# EAGLE design usb-midi-shield (EAGLE 6.1)
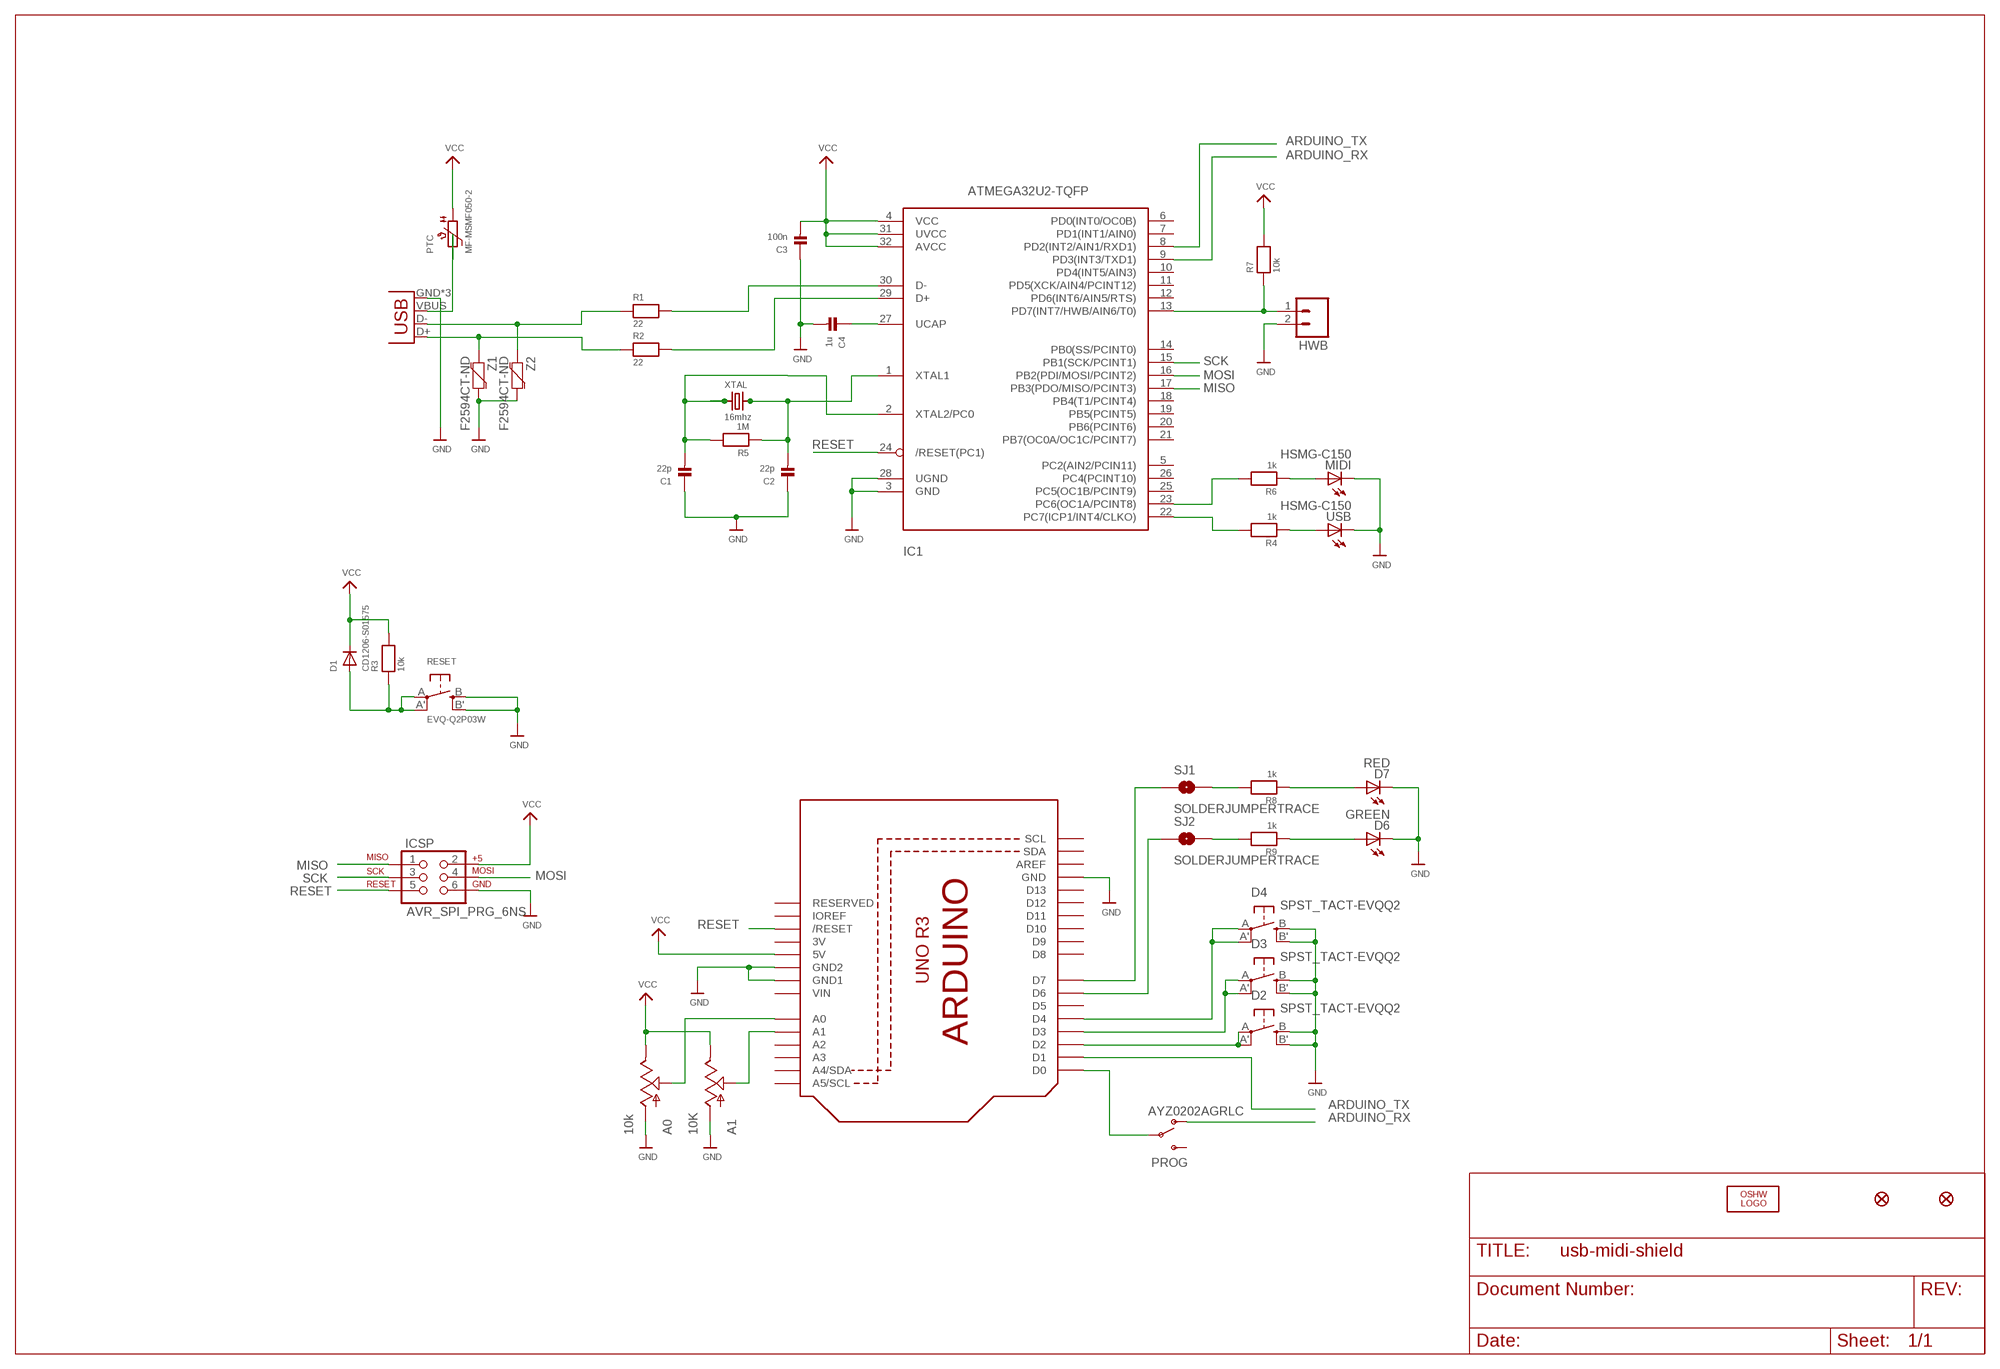
[diagram p0: schematic, sheet 1]

## Parts
A0  10k  POT  [ALPS_POT]
A1  10K  POT  [ALPS_POT]
C1  22p  CAP_CERAMIC0603  [0603]
C2  22p  CAP_CERAMIC0603  [0603]
C3  100n  CAP_CERAMIC0603  [0603]
C4  1u  CAP_CERAMIC0603  [0603]
D1  CD1206-S01575  DIODESOD-123  [SOD-123]
D2  SPST_TACT-EVQQ2  [EVQ-Q2]
D3  SPST_TACT-EVQQ2  [EVQ-Q2]
D4  SPST_TACT-EVQQ2  [EVQ-Q2]
D6  GREEN  LED-GREENLARGE  [LED-1206]
D7  RED  LED-GREENLARGE  [LED-1206]
FID1  FIDUCIAL1.5X3  [FIDUCIAL-1.5X3]
FID2  FIDUCIAL1.5X3  [FIDUCIAL-1.5X3]
HWB  M02LOCK  [1X02_LOCK]
IC1  ATMEGA32U2-TQFP  [TQFP32-08]
ICSP  AVR_SPI_PRG_6NS  [2X3-NS]
JP1  USB-MICROB  [USB-MICROB]
LOGO1  OSHW_LOGO_FILLX0350-NT  [OSHW_FILLX350_NOTEXT]
MIDI  HSMG-C150  LED-GREENLARGE  [LED-1206]
PROG  AYZ0202AGRLC  SWITCH-SPDTSMD  [AYZ0202]
PTC  MF-MSMF050-2  PTC1812  [PTC1812]
R1  22  RESISTOR0805  [0805]
R2  22  RESISTOR0805  [0805]
R3  10k  RESISTOR0805  [0805]
R4  1k  RESISTOR0805  [0805]
R5  1M  RESISTOR0805  [0805]
R6  1k  RESISTOR0805  [0805]
R7  10k  RESISTOR0805  [0805]
R8  1k  RESISTOR0805  [0805]
R9  1k  RESISTOR0805  [0805]
RESET  EVQ-Q2P03W  SWITCH_TACT_SMT  [EVQ-Q2]
SJ1  SOLDERJUMPERTRACE  [SJ_2S-TRACE]
SJ2  SOLDERJUMPERTRACE  [SJ_2S-TRACE]
U1  ARDUINOR3NODIM  [ARDUINOR3-NODIM]
USB  HSMG-C150  LED-GREENLARGE  [LED-1206]
XTAL  16mhz  CRYSTALSMD  [HC49UP]
Z1  F2594CT-ND  VARISTOR-0603  [0603-RES]
Z2  F2594CT-ND  VARISTOR-0603  [0603-RES]

## Nets
ARDUINO_RX: IC1.9(PD3(INT3/TXD1)) PROG.1(O)
ARDUINO_TX: IC1.8(PD2(INT2/AIN1/RXD1)) U1.D1
D-: IC1.29(D+) R2.2
GND: A0.P$3(A) A1.P$3(A) C1.1 C2.1 C3.1 C4.2 D2.B'(S1) D2.B(S) D3.B'(S1) D3.B(S) D4.B'(S1) D4.B(S) D6.C D7.C HWB.2 IC1.3(GND) IC1.28(UGND) ICSP.6 JP1.GND JP1.MT1(GND) JP1.MT2(GND) MIDI.C RESET.B'(S1) RESET.B(S) U1.GND U1.GND1 U1.GND2 USB.C Z1.2 Z2.2
MISO: IC1.17(PB3(PDO/MISO/PCINT3)) ICSP.1
MOSI: IC1.16(PB2(PDI/MOSI/PCINT2)) ICSP.4
N$1: HWB.1 IC1.13(PD7(INT7/HWB/AIN6/T0)) R7.1
N$2: C1.2 IC1.2(XTAL2/PC0) R5.2 XTAL.1
N$3: JP1.D+ R2.1 Z1.1
N$4: C2.2 IC1.1(XTAL1) R5.1 XTAL.2
N$5: IC1.30(D-) R1.2
N$7: D2.A'(P1) D2.A(P) U1.D2
N$8: D3.A'(P1) D3.A(P) U1.D3
N$9: C4.1 IC1.27(UCAP)
N$10: JP1.VBUS PTC.P$2
N$13: IC1.23(PC6(OC1A/PCINT8)) R6.2
N$15: IC1.22(PC7(ICP1/INT4/CLKO)) R4.2
N$16: MIDI.A R6.1
N$18: R4.1 USB.A
N$20: D4.A'(P1) D4.A(P) U1.D4
N$23: JP1.D- R1.1 Z2.1
N$26: A1.P$2(S) U1.A1
N$27: A0.P$2(S) U1.A0
N$29: R8.2 SJ1.2
N$30: D7.A R8.1
N$32: R9.2 SJ2.2
N$33: D6.A R9.1
N$34: SJ2.1 U1.D6
N$36: SJ1.1 U1.D7
N$37: PROG.2(P) U1.D0
RESET: D1.A IC1.24(/RESET(PC1)) ICSP.5 R3.1 RESET.A'(P1) RESET.A(P) U1.RESET(/RESET)
SCK: IC1.15(PB1(SCK/PCINT1)) ICSP.3
VCC: A0.P$1(E) A1.P$1(E) C3.2 D1.C IC1.4(VCC) IC1.31(UVCC) IC1.32(AVCC) ICSP.2 PTC.P$1 R3.2 R7.2 U1.5V
Unconnected: IC1.5(PC2(AIN2/PCIN11)) IC1.6(PD0(INT0/OC0B)) IC1.7(PD1(INT1/AIN0)) IC1.10(PD4(INT5/AIN3)) IC1.11(PD5(XCK/AIN4/PCINT12)) IC1.12(PD6(INT6/AIN5/RTS)) IC1.14(PB0(SS/PCINT0)) IC1.18(PB4(T1/PCINT4)) IC1.19(PB5(PCINT5)) IC1.20(PB6(PCINT6)) IC1.21(PB7(OC0A/OC1C/PCINT7)) IC1.25(PC5(OC1B/PCINT9)) IC1.26(PC4(PCINT10)) PROG.3(S) U1.A2 U1.A3 U1.A4(A4/SDA) U1.A5(A5/SCL) U1.AREF U1.D5 U1.D8 U1.D9 U1.D10 U1.D11 U1.D12 U1.D13 U1.IOREF U1.RESERVED U1.SCL U1.SDA

## Power pins joined to a net without a drawn wire
3V: U1.3V
VIN: U1.VIN

## Library data of the parts
A0 A1 = SparkFun-Electromechanical:POT
C1-C4 = microbuilder:CAP_CERAMIC: Ceramic Capacitors 0402 - 0402 Surface Mount Capacitors 16pF 50V 5% [Digikey: 445-4899-2-ND] 18pF 50V 5% [Digikey: 490-1281-2-ND] 22pF 50V 5% [Digikey: 490-1283-2-ND] 68pF 50V 5% [Digikey: 490-1289-2-ND] 0.1uF 10V 10% [Digikey: 490-1318-2-ND] 1.0uF 6.3V 10% [Digikey: 490-1320-2-ND] 0603 - 0603 Surface Mount Capacitors 16 pF 50V 5% [Digikey: 445-5051-2-ND] 22 pF 50V [Digikey: PCC220ACVTR-ND] 33 pF 50V 5% [Digikey: 490-1415-1-ND] 56pF 50V 5% [Digikey: 490-1421-1-ND] 220pF 50V 5% [Digikey: 445-1285-1-ND] 680 pF 50V 2200 pF 50V 5% C0G [Digikey: 445-1297-1-ND] 5600 pF 100V 5% X7R [Digikey: 478-3711-1-ND] 0.1 µF 25V 10% [Digikey: PCC2277TR-ND] 0.22 µF 16V 10% X7R [Digikey: 445-1318-1-ND] 1.0 µF 25V 10% [Digikey: 445-5146-2-ND] 0603 - RF Specific 3pF 250V +/-0.1pF RF [Digikey: 712-1347-1-ND] 18 pF 250V 5% [Digikey: 478-3505-1-ND or 712-1322-1-ND] 56 pF 250V 5% C0G RF [Digikey: 490-4867-1-ND] 68 pF 250V RF [Digikey: 490-4868-1-ND] 0805 - 0805 Surface Mount Capacitors 220 pF 250V 2% RF Ceramic Capacitor [Digikey: 712-1398-1-ND] 1000 pF 50V 2% NP0 Ceramic Capacitor [Digikey: 478-3760-1-ND] 0.1 µF 25V 10% Ceramic Capacitor [Digikey: PCC1828TR-ND] 1.0 µF 16V 10% Ceramic Capacitor[Digikey: 490-1691-2-ND] 10.0 µF 10V 10% Ceramic Capacitor[Digikey: 709-1228-1-ND] 10.0 uF 16V 10% Ceramic Capacitor [Digikey: 478-5165-2-ND] 47 uF 6.3V 20% Ceramic Capacitor [Digikey: 587-1779-1-ND or 399-5506-1-ND] 1206 - 1206 Surface Mount Capacitors 47uF 10V 20% Ceramic Capacitor [Digikey: 490-5528-1-ND or 399-5508-1-ND or 445-6010-1-ND] 100uF 6.3V -20%, +80% Y5V Ceramic Capacitor (Digikey: 490-4512-1-ND, Mouser: 81-GRM31CF50J107ZE1L)
D1 = microbuilder:DIODE: Diode SMA Model Volts Amps Type Vf Vr Digikey # Notes SSA34-E3 40V 3A Schottky 480mV @ 3A 200uA @ 40V SSA34-E3/61TGITR-ND CDBA120-G 20V 1A Schottky 500mV @ 1A 500uA @ 20V 641-1014-6-ND REEL MBRA210 10V 2A Schottky 350mV @ 2A 700uA @ 10V MBRA210LT3 SOD-123 Model Volts Amps Type Vf Vr Order # Notes BAT54T1G 30V 200mA Schottky 800mV @ 200mA 2uA @ 25V BAT54T1GOSTR-ND B0530W 30V 500mA Schottky 430mV @ 500mA 130uA @ 30V B0530W-FDICT-ND REEL MBR120 1A 20V Schottky 340mV @ 1A MBR120VLSFT1GOSCT-ND SOD-323 Model Volts Amps Type Vf Vr Order # Notes PMEG2005EJ 20V 500mA Schottky 355mV @ 500mA 568-4110-1-ND ZLLS410 10V 570mA Schottky 380mV @ 570mA ZLLS410CT-ND 1N4148WS 75V 150mA Silicon/Simple 1V 1N4148WSFSCT-ND REEL SOD-523 Model Volts Amps Type Vf Vr Order # Notes BAT54XV2 30V 200mA Schottky 0.8V @ 100mA BAT54XV2CT-ND TB751S 30V 30mA Schottky RB751S-40TE61CT-ND SOT23-R/W (R = Solder Paste/Reflow Ovens, W = Hand-Soldering) Model Volts Amps Type Vf Vr Order # Notes BAT54FILM 40V 300mA Schottky 497-7162-1-ND
D2-D4 = adafruit:SPST_TACT: SMT 6mm switch, EVQQ2 series http://www.ladyada.net/library/eagle
D6 = SparkFun-LED:LED-GREEN: Various green LEDs 0603- DIO-00821 LARGE- DIO-00862 LILYPAD- DIO-09910; PROD_ID: DIO-00862
D7 MIDI USB = SparkFun-LED:LED-GREEN: Various green LEDs 0603- DIO-00821 LARGE- DIO-00862 LILYPAD- DIO-09910; PROD_ID: DIO-00862; VALUE: GREEN
FID1 FID2 = SparkFun-Aesthetics:FIDUCIAL: Fiducial Alignment Points Various fiducial points for machine vision alignment.
HWB = SparkFun-Connectors:M02: Header 2 Standard 2-pin 0.1" header. Use with straight break away headers (SKU : PRT-00116), right angle break away headers (PRT-00553), swiss pins (PRT-00743), machine pins (PRT-00117), and female headers (PRT-00115). Molex polarized connector foot print use with SKU : PRT-08233 with associated crimp pins and housings.
IC1 = adafruit:ATMEGA32U2: ATmega32u2 Pin compatible with the atmega8u2, atmega16u2 and atmega32u2 8, 16 or 32 K flash, 1K RAM, 512b EEPROM 8 bit and 16 bit timer (5 PWM total) UART, SPI (no I2C!) USB with 4 endpoints, LUFA compatible 22 I/O lines, analog comparator (no ADC!) Comes with DFU bootloader burned in!
ICSP = SparkFun-Connectors:AVR_SPI_PRG_6: AVR ISP 6 Pin This is the reduced ISP connector for AVR programming. Common on Arduino. This footprint will take up less PCB space and can be used with a 10-pin to 6-pin adapter such as SKU: BOB-08508
JP1 = SparkFun-Connectors:USB: USB Connectors USB-B-PTH is fully proven SKU : PRT-00139/CONN-08278 USB-miniB is fully proven SKU : PRT-00587 USB-A-PCB is untested. USB-A-H is throughly reviewed, but untested. Spark Fun Electronics SKU : PRT-00437 USB-B-SMT is throughly reviewed, but untested. Needs silkscreen touching up. USB-A-S has not been used/tested USB-MB-H has not been used/tested USB-MICROB has been used. CONN-09505; PROD_ID: CONN-09505
LOGO1 = ohw-logo:OSHW_LOGO_FILL
PROG = SparkFun-Electromechanical:SWITCH-SPDT: SPDT Switch Simple slide switch, Spark Fun Electronics SKU : COM-00102 DPDT SMT slide switch, AYZ0202, SWCH-08179; PROD_ID: SWCH-08179
PTC = microbuilder:PTC: PTC (Resettable Fuse) 1206 Package 250mA PTC (16V Max, Time-to-Trip: 0.08s) - Digikey: F2110CT-ND 1210 Package 100mA PTC (30V Max, Time-to-Trip: 0.6s) - Digikey: MF-USMF010-2CT-ND 1812 Package 750mA PTC (24V Max, Time-to-Trip: 0.2s) - Digikey: MF-MSMF075/24-2CT-ND
R1-R9 = microbuilder:RESISTOR: Resistors 0402 - 0402 Surface Mount Package 22 Ohm 1% 1/16W [Digikey: 311-22.0LRTR-ND] 33 Ohm 5% 1/16W 1.0K 5% 1/16W 1.5K 5% 1/16W 2.0K 1% 1/16W 10.0K 1% 1/16W [Digikey: 311-10.0KLRTR-ND] 10.0K 5% 1/16W [Digikey: RMCF0402JT10K0TR-ND] 12.1K 1% 1/16W [Digikey: 311-22.0LRTR-ND] 100.0K 5% 1/16W 0603 - 0603 Surface Mount Package 0 Ohm 1/10 Watt 1% Resistor 15 Ohm 1/10 Watt 1% Resistor 33 Ohm 1/10 Watt 1% Resistor 49.9 Ohm 1/10 Watt 1% Resistor 100 Ohm 1/10 Watt 1% Resistor 150 Ohm 1/10 Watt 1% Resistor 240 Ohm 1/10 Watt 1% Resistor 390 Ohm 1/10 Watt 1% Resistor 560 Ohm 1/10 Watt 1% Resistor 680 Ohm 1/10 Watt 1% Resistor 750 Ohm 1/10 Watt 1% Resistor 1.0K Ohm 1/10 Watt 1% Resistor 1.5K Ohm 1/10 Watt 1% Resistor 2.0K Ohm 1/10 Watt 1% Resistor 2.2K Ohm 1/10 Watt 1% Resistor 3.3K Ohm 1/10 Watt 1% Resistor 4.7K Ohm 1/10 Watt 1% Resistor 10.0K Ohm 1/10 Watt 1% Resistor 12.0K Ohm 1/10 Watt 1% Resistor 12.1K Ohm 1/10 Watt 1% Resistor 20.0K Ohm 1/10 Watt 1% Resistor 33.0K Ohm 1/10 Watt 1% Resistor 100.0K Ohm 1/10 Watt 1% Resistor 0805 - 0805 Surface Mount Package 0 Ohm 1/8 Watt 1% Resistor 33 Ohm 1/8 Watt 1% Resistor 100 Ohm 1/8 Watt 1% Resistor 150 Ohm 1/8 Watt 1% Resistor 200 Ohm 1/8 Watt 1% Resistor 240 Ohm 1/8 Watt 1% Resistor 330 Ohm 1/8 Watt 1% Resistor 390 Ohm 1/8 Watt 1% Resistor 470 Ohm 1/8 Watt 1% Resistor 1.0K Ohm 1/8 Watt 1% Resistor 1.5K Ohm 1/8 Watt 1% Resistor 2.0K Ohm 1/8 Watt 1% Resistor 4.7K Ohm 1/8 Watt 1% Resistor 5.1K Ohm 1/8 Watt 1% Resistor 5.6K Ohm 1/8 Watt 1% Resistor 10.0K Ohm 1/8 Watt 1% Resistor 22.0K Ohm 1/8 Watt 1% Resistor 33.0K Ohm 1/8 Watt 1% Resistor 100K Ohm 1/8 Watt 1% Resistor 1206 - 1206 Surface Mount Package 2012 - 2010 Surface Mount Package 0.11 Ohm 1/2 Watt 1% Resistor - Digikey: RHM.11UCT-ND
RESET = microbuilder:SWITCH_TACT_SMT: SMT Tact Switches 6x6mm - Digikey: P12940SCT-ND KMR2 (4.6x2.8mm) - Digikey: 401-1426-1-ND EVQ-PQHB55 - Light Touch, 160GF (4.5x4.5mm) - Digikey: P8090SCT-ND
SJ1 SJ2 = SparkFun-Passives:SOLDERJUMPER: Solder Jumper Standard SMD solder jumper. Used to automate production. Two varients : Normally Open and Normally Closed are the same, but have different paste layers. NC will have a large amount of paste and should jumper during reflow.
U1 = microbuilder:ARDUINOR3: This is a new object for the new Arduino R3 - with extra pins that you may want to use (such as IOref, and duplicated A4/A5
XTAL = microbuilder:CRYSTAL: Crystals HC49UP - Surface Mount Crystal 4.0MHz 18pF +/-30ppm Surface Mount Crystal [Digikey: 535-9857-1-ND] 12.0 MHz Surface Mount Crystal [Digikey: 535-9869-6-ND] 25.0 MHz Surface Mount Crystal [Digikey: 535-9078-1-ND] 2.5 x 2.0mm - MEMs SMT Crystal 16.0 MHz 10pF 20ppm 2.5 x 2.0mm Crystal [Digikey -40-85°C: 535-10923-1-ND] 3.2 x 2.5mm - MEMs SMT Crystal 12.0 MHz 8pF 15ppm 3.2 x 2.5mm Crystal [Digikey: -10-70°C: 644-1047-1-ND -40-125°C: 644-1128-1-ND] 16.0 MHz 8pF 15ppm 3.2 x 2.5mm Crystal [Digikey: -10-70°C: 644-1049-1-ND -40-125°C: 644-1129-2-ND] 16.0 MHz 10pF 10ppm 3.2 x 2.5mm Crystal [Digikey: 644-1100-1-ND] 27.12 MHz 18pF 30ppm 3.2 x 2.5mm Crystal [Digikey: 887-1424-1-ND] 27.12MHz 10pF 10ppm 3.2 x 2.5mm Crystal [Digikey: 887-1329-1-ND] 4.9 x 1.8mm - MEMs SMT Crystal 32.768 KHz 12.5pF 20ppm 4.9 x 1.8mm Crystal [Digikey: SE2415CT-ND] 8.0 x 3.8mm - Surface Mount Crystal 32.768kHz 12.5pF 20ppm -40°C-85°C [Digikey: 535-9166-2-ND] Cylinder 32.768KHz Cylinder Crystal (2x6mm body) [Ex. Digikey: 300-8341-2-ND]
Z1 Z2 = SparkFun-DiscreteSemi:VARISTOR: Varistor Varistor (Variable resistor) is a nonlinear resistive element of the voltage dependence that resistance changes with applied voltage. Varistor is equivalent with Zener diode of two series connection.

## Board
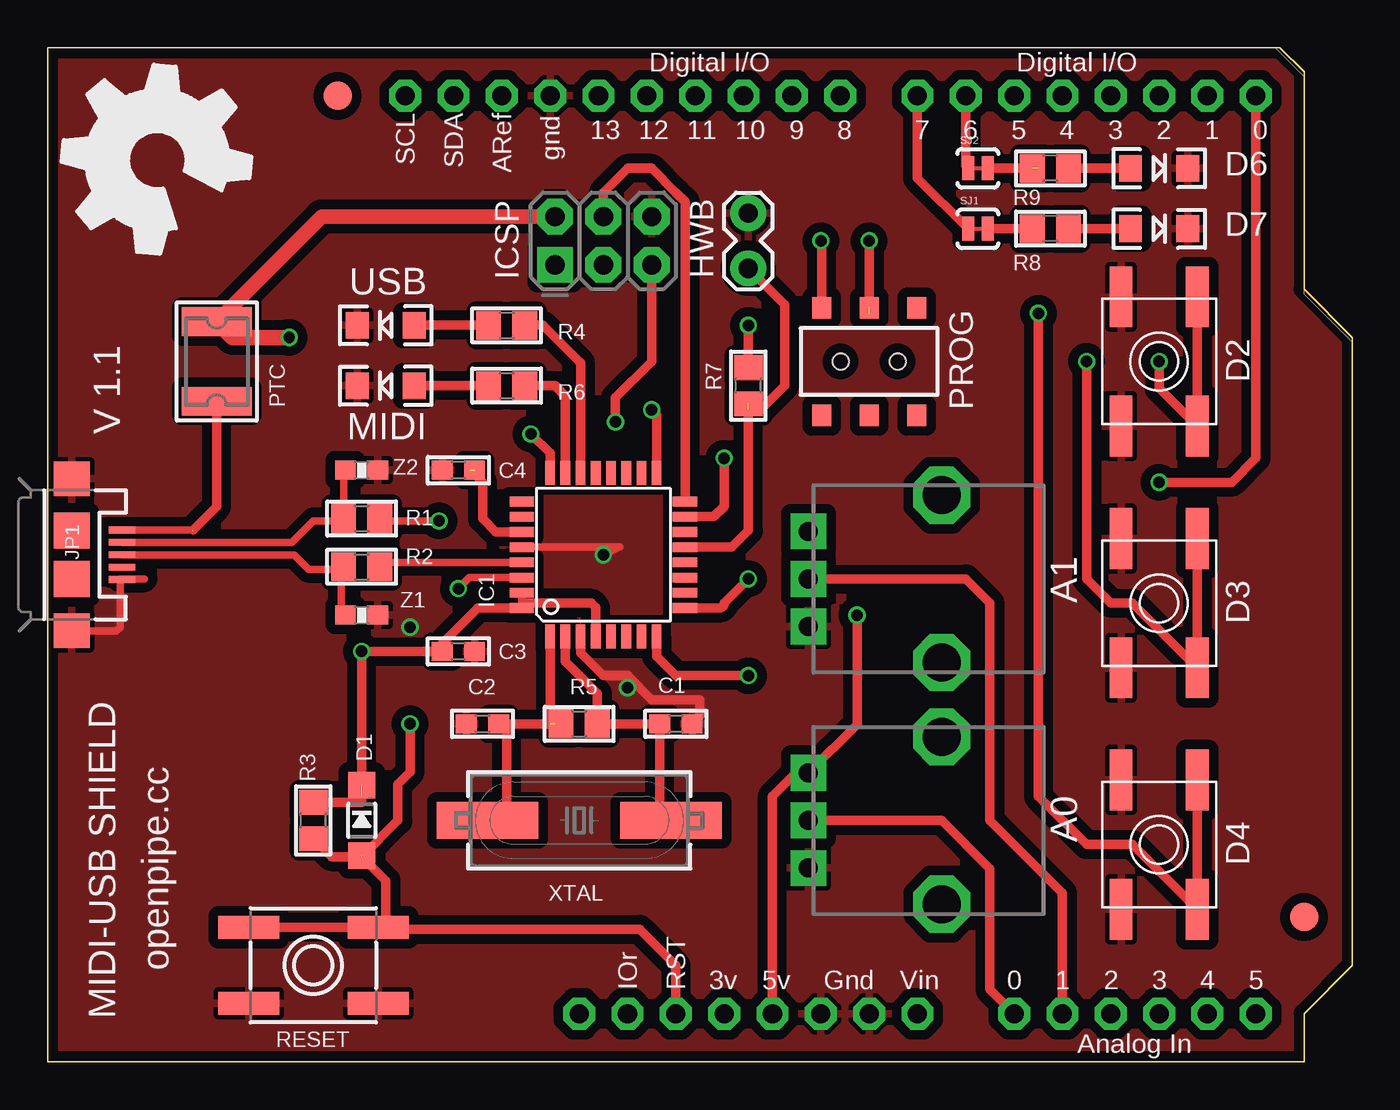
[diagram p1: board, top side]
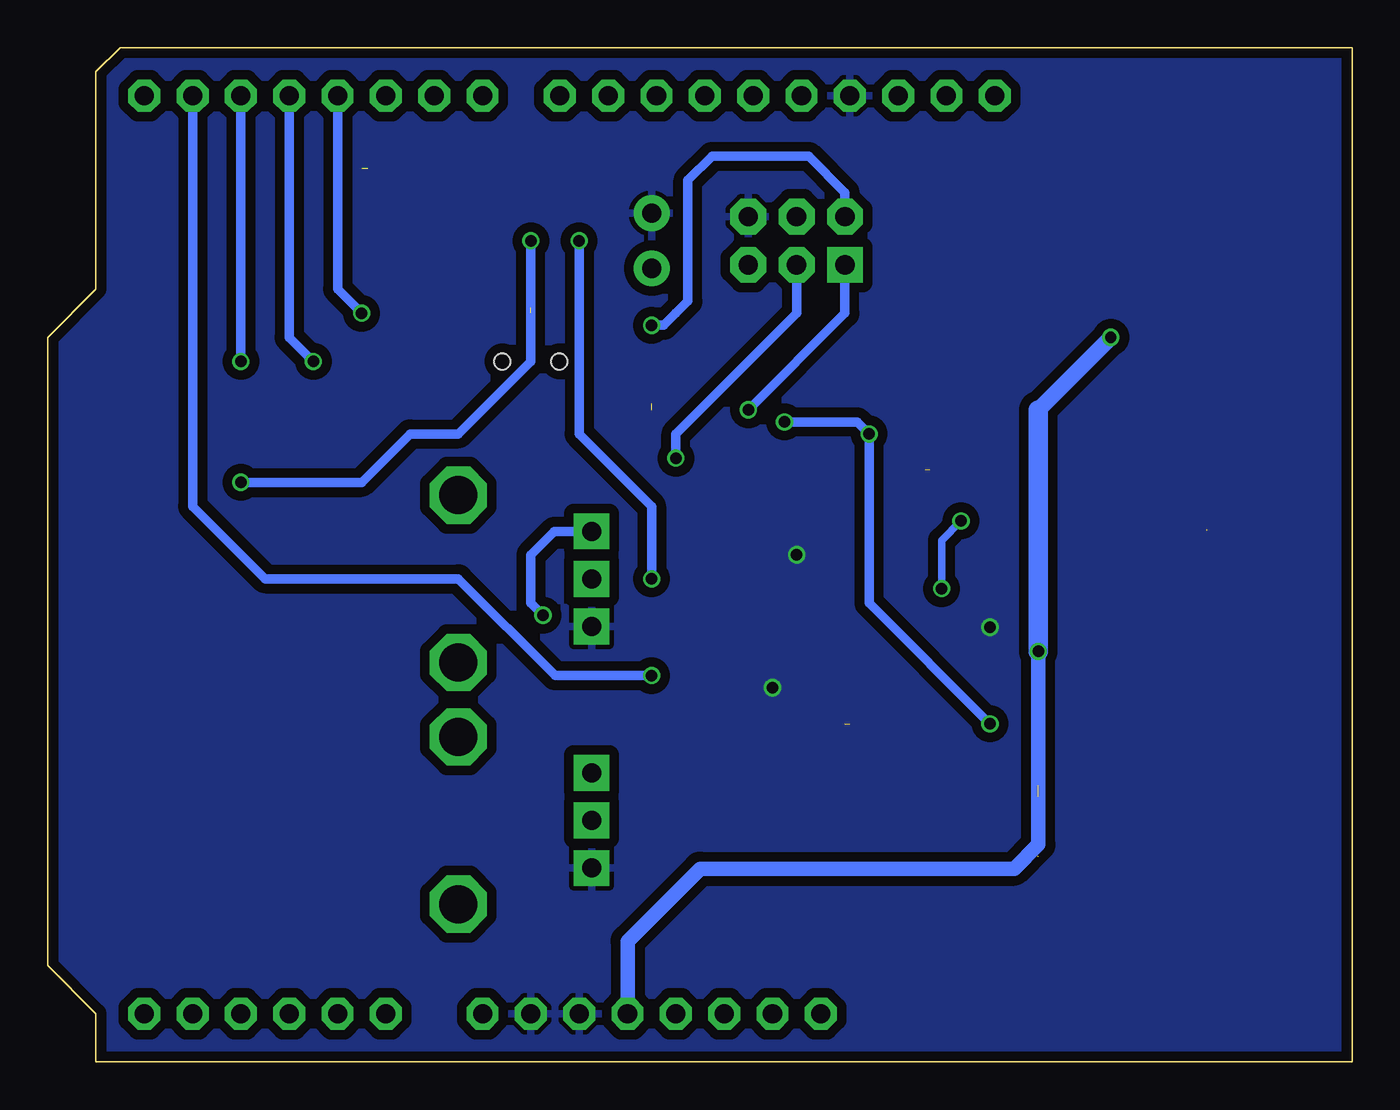
[diagram p2: board, bottom side, seen from below]

Size 68.58 x 53.34 mm. Coordinates in mm from the lower left corner, seen from the top.
Outline: 0,0 0,53.34 64.77,53.34 66.04,52.07 66.04,40.64 68.58,38.1 68.58,5.08 66.04,2.54 66.04,0 0,0
Copper layers (1*16): Top 0.035mm / dielectric 1.5mm / Bottom 0.035mm
Design rules: minimum track width 6mil, minimum drill 12mil, track to track 6mil, track to pad 6mil, pad to pad 6mil, via to via 6mil, smd to smd 0mil, copper to edge 10mil, drill to drill 10mil, minimum pad ring 10mil, minimum via ring 6mil, stop-mask expansion 2mil, vias tented up to drill 100mil, thermal gap 10mil

### Footprints (pad centres in the part's own frame; a part is rotated, then mirrored left to right if it is on the bottom)
ALPS_POT = drill 1 pad 1.88 square: P$1 7,-2.5; P$2 7,0; P$3 7,2.5 | drill 2 octagon: P$4 0,-4.4; P$5 0,4.4
0603 = smd 1.1 x 1: 1 -0.85,0; 2 0.85,0
SOD-123 = smd 1.4 x 1.4: A 1.85,0; C -1.85,0
EVQ-Q2 = smd 3.2 x 1.2: A -3.4,-2; A' 3.4,-2; B -3.4,2; B' 3.4,2
LED-1206 = smd 1.2 x 1.4: A -1.5,0; C 1.5,0
FIDUCIAL-1.5X3 = smd 1.5 x 1.5: 1 0,0
1X02_LOCK = drill 1.016 pad 1.88: 1 -0.178,0; 2 2.718,0
TQFP32-08 = smd 1.27 x 0.508: 1 -4.293,2.8; 2 -4.293,2; 3 -4.293,1.2; 4 -4.293,0.4; 5 -4.293,-0.4; 6 -4.293,-1.2; 7 -4.293,-2; 8 -4.293,-2.8; 17 4.293,-2.8; 18 4.293,-2; 19 4.293,-1.2; 20 4.293,-0.4; 21 4.293,0.4; 22 4.293,1.2; 23 4.293,2; 24 4.293,2.8 | smd 0.508 x 1.27: 9 -2.8,-4.293; 10 -2,-4.293; 11 -1.2,-4.293; 12 -0.4,-4.293; 13 0.4,-4.293; 14 1.2,-4.293; 15 2,-4.293; 16 2.8,-4.293; 25 2.8,4.293; 26 2,4.293; 27 1.2,4.293; 28 0.4,4.293; 29 -0.4,4.293; 30 -1.2,4.293; 31 -2,4.293; 32 -2.8,4.293
2X3-NS = drill 1.016 pad 1.88 square: 1 -2.54,-1.27 | drill 1.016 pad 1.88 octagon: 2 -2.54,1.27; 3 0,-1.27; 4 0,1.27; 5 2.54,-1.27; 6 2.54,1.27
USB-MICROB = smd 0.35 x 1.4: D+ 0,2.65; D- -0.65,2.65; GND 1.3,2.65; ID 0.65,2.65; VBUS -1.3,2.65 | smd 1.8 x 1.9: MT1 -4,0; MT2 4,0 | smd 1.9 x 1.9: P$1 -1.27,0; P$2 1.27,0
AYZ0202 = smd 1 x 1.15: 1 -2.5,2.825; 2 0,2.825; 3 2.5,2.825; 4 -2.5,-2.825; 5 0,-2.825; 6 2.5,-2.825 | hole 0.85: 1.5,0; -1.5,0
PTC1812 = smd 1.5 x 3.7: P$1 -2.1,0; P$2 2.1,0
0805 = smd 1.3 x 1.5: 1 -0.95,0; 2 0.95,0
SJ_2S-TRACE = smd 0.635 x 1.27: 1 -0.508,0; 2 0.508,0
ARDUINOR3-NODIM = drill 1 pad 1.676 octagon: 3V 35.56,2.54; 5V 38.1,2.54; A0 50.8,2.54; A1 53.34,2.54; A2 55.88,2.54; A3 58.42,2.54; A4 60.96,2.54; A5 63.5,2.54; AREF 23.876,50.8; D0 63.5,50.8; D1 60.96,50.8; D2 58.42,50.8; D3 55.88,50.8; D4 53.34,50.8; D5 50.8,50.8; D6 48.26,50.8; D7 45.72,50.8; D8 41.656,50.8; D9 39.116,50.8; D10 36.576,50.8; D11 34.036,50.8; D12 31.496,50.8; D13 28.956,50.8; GND 26.416,50.8; GND1 43.18,2.54; GND2 40.64,2.54; IOREF 30.48,2.54; RESERVED 27.94,2.54; RESET 33.02,2.54; SCL 18.796,50.8; SDA 21.336,50.8; VIN 45.72,2.54
HC49UP = smd 5.334 x 1.93: 1 -4.826,0; 2 4.826,0
0603-RES = smd 1.1 x 1: 1 -0.85,0; 2 0.85,0

### Placement (x,y rotation side)
A0  46.99,12.7 180 top
A1  46.99,25.4 180 top
C1  33.02,17.78 180 top
C2  22.86,17.78 0 top
C3  21.59,21.59 180 top
C4  21.59,31.12 180 top
D1  16.51,12.7 270 top
D2  58.42,36.83 90 top
D3  58.42,24.13 90 top
D4  58.42,11.43 90 top
D6  58.42,46.99 0 top
D7  58.42,43.82 0 top
FID1  66.04,7.62 0 top
FID2  15.24,50.8 0 top
HWB  36.83,41.91 90 top
IC1  29.21,26.67 90 top
ICSP  29.21,43.18 0 top
JP1  1.27,26.67 270 top
LOGO1  4.44,41.27 40 top
MIDI  17.78,35.56 180 top
PROG  43.18,36.83 0 top
PTC  8.89,36.83 270 top
R1  16.51,28.58 0 top
R2  16.51,26.03 0 top
R3  13.97,12.7 90 top
R4  24.13,38.73 0 top
R5  27.94,17.78 0 top
R6  24.13,35.56 0 top
R7  36.83,35.56 90 top
R8  52.71,43.82 180 top
R9  52.71,46.99 180 top
RESET  13.97,5.08 180 top
SJ1  48.9,43.82 0 top
SJ2  48.9,46.99 0 top
U1  0,0 0 top
USB  17.78,38.73 180 top
XTAL  27.94,12.7 180 top
Z1  16.51,23.49 0 top
Z2  16.51,31.12 0 top

### Tracks (layer width: path | path; a pad name or v marks a point on that pad's centre or on a via)
ARDUINO_RX  (via drill 0.6)
  Top 0.508: PROG.1 40.68,43.14 v40.64,43.18 | v36.83,25.4 35.56,24.13 arc-90 35.3,23.87 IC1.9
  Bottom 0.508: v40.64,43.18 40.64,33.02 36.83,29.21 v36.83,25.4
ARDUINO_TX  (via drill 0.6)
  Top 0.508: v36.83,20.32 33.02,20.32 32.39,20.95 32.01,21.33 IC1.8
  Bottom 0.508: U1.D1 60.96,29.21 57.15,25.4 46.99,25.4 41.91,20.32 v36.83,20.32
D-
  Top 0.406: IC1.29 17.7,26.27 R2.2
GND  (via drill 0.6)
  Top 0.406: IC1.28 30.08,27.07 v29.21,26.67 | JP1.MT2 3.62,22.67 3.81,22.86 3.81,25.26 JP1.GND
  Top 0.508: IC1.3 28.01,21.52 29.21,20.32 30.48,20.32 31.75,19.05 33.02,19.05 34.29,19.05 34.29,18.2 C1.1
  other vias: 19.05,22.86 30.48,19.69
  pour Bottom (isolate 0.508): 0,0 0,53.34 64.77,53.34 66.04,52.07 66.04,40.64 68.58,38.1 68.58,5.08 66.04,2.54 66.04,0
  pour Top (isolate 0.508): 0,0 0,53.34 64.77,53.34 66.04,52.07 66.04,40.64 68.58,38.1 68.58,5.08 66.04,2.54 66.04,0
MISO  (via drill 0.6)
  Top 0.508: IC1.17 32.01,34.03 v31.75,34.29
  Bottom 0.508: ICSP.1 26.67,40.64 26.67,39.37 v31.75,34.29
MOSI
  Top 0.508: IC1.16 33.5,45.24 33.02,45.72 31.75,46.99 30.48,46.99 29.21,45.72 ICSP.4
N$1  (1 unrouted)
  Top 0.508: IC1.13 35.96,27.07 36.83,27.94 36.83,34.29 37.47,34.29 38.73,35.56 38.73,39.83 HWB.1
N$2
  Top 0.508: XTAL.1 32.17,12.7 C1.2 R5.2 28.89,19.37 27.94,20.32 27.21,21.05 IC1.2
N$3
  Top 0.406: JP1.D+ 12.95,26.67 13.72,25.91 15.43,25.91 | 15.43,25.91 R2.1 | 15.43,25.91 15.43,23.72 Z1.1
N$4  (1 unrouted)
  Top 0.508: XTAL.2 24.13,12.7 24.13,17.78 | 24.13,17.78 26.67,17.78 | C2.2 24.13,17.78 | IC1.1 26.41,17.78 R5.1
N$5  (via drill 0.6)
  Top 0.406: IC1.30 22.17,25.47 v21.59,24.89 | v20.57,28.45 17.59,28.45 R1.2
  Bottom 0.406: v21.59,24.89 21.59,27.43 v20.57,28.45
N$6
  Top 0.406: 3.81,25.4 5.08,25.4 3.81,25.4
N$7  (via drill 0.6)
  Top 0.508: v58.42,36.83 58.42,35.43 D2.A D2.A'
  Bottom 0.508: U1.D2 v58.42,36.83
N$8  (via drill 0.6)
  Top 0.508: v54.61,36.83 54.61,25.4 55.88,24.13 57.02,24.13 D3.A D3.A'
  Bottom 0.508: U1.D3 55.88,38.1 v54.61,36.83
N$9  (1 unrouted)
  Top 0.508: IC1.27 23.56,27.87 22.86,28.58 22.86,30.48 22.22,31.12
N$10  (1 unrouted)
  Top 0.406: JP1.VBUS 7.59,27.97 7.62,27.94
  Top 0.508: 7.65,27.97 8.89,29.21 PTC.P$2
N$13
  Top 0.508: IC1.23 27.21,35.02 26.67,35.56 R6.2
N$15
  Top 0.508: IC1.22 28.01,36.76 27.94,36.83 26.04,38.73 R4.2
N$16
  Top 0.508: R6.1 MIDI.A
N$18
  Top 0.508: R4.1 USB.A
N$20  (via drill 0.6)
  Top 0.508: v52.07,39.37 52.07,13.97 54.61,11.43 57.02,11.43 D4.A D4.A'
  Bottom 0.508: U1.D4 53.34,40.64 v52.07,39.37
N$23
  Top 0.406: JP1.D- 12.84,27.32 13.97,28.45 15.43,28.45 R1.1 15.56,31.02 Z2.1
N$26
  Top 0.508: A1.P$2 48.26,25.4 49.53,24.13 49.53,12.7 53.34,8.89 U1.A1
N$27
  Top 0.508: A0.P$2 46.99,12.7 49.53,10.16 49.53,3.81 U1.A0
N$29
  Top 0.508: SJ1.2 R8.2
N$30
  Top 0.508: R8.1 D7.A
N$32  (1 unrouted)
  Top 0.508: SJ2.2 52.07,46.99
N$33
  Top 0.508: R9.1 D6.A
N$34
  Top 0.508: U1.D6 48.26,47.12 SJ2.1
N$36
  Top 0.508: U1.D7 45.72,46.48 SJ1.1
N$37  (via drill 0.6)  (1 unrouted)
  Top 0.508: U1.D0 63.5,31.75 62.23,30.48 v58.42,30.48 | v43.18,43.18 43.18,39.37
  Bottom 0.508: v58.42,30.48 52.07,30.48 49.53,33.02 46.99,33.02 43.18,36.83 v43.18,43.18
RESET  (via drill 0.6)  (1 unrouted)
  Top 0.508: R3.1 14.93,10.79 16.51,10.79 | 16.51,10.79 17.78,9.53 17.78,7.62 | 17.78,7.62 17.78,6.98 | 17.78,6.98 17.78,7.62 | 17.78,6.98 31.11,6.98 33.02,5.08 U1.RESET | RESET.A' RESET.A 17.68,7.08 17.78,6.98 | IC1.24 26.41,32.01 v25.4,33.02 | v29.85,33.66 29.85,34.93 31.75,36.83 ICSP.5 | 16.51,10.79 18.41,12.7 18.41,14.6 19.05,15.24 v19.05,17.78
  Bottom 0.508: v29.85,33.66 26.04,33.66 v25.4,33.02 25.4,24.13 v19.05,17.78
SCK  (via drill 0.6)
  Top 0.508: IC1.15 35.02,28.67 35.56,29.21 v35.56,31.75
  Bottom 0.508: v35.56,31.75 35.56,33.02 29.21,39.37 ICSP.3
VCC  (via drill 0.6)  (1 unrouted)
  Top 0.406: IC1.31 IC1.32
  Top 0.508: U1.5V 38.1,13.97 39.37,15.24 39.95,15.24 A0.P$1 42.55,17.76 v42.55,23.49 | R7.2 v36.83,38.73 | 20.32,21.59 v16.51,21.59 D1.C | 20.32,21.59 C3.2 | R3.2 16.51,13.65 16.51,13.97 | 20.32,21.59 22.6,23.87 IC1.32 arc-90 25.18,24.13 25.4,24.13 28.57,24.13 28.81,23.9 IC1.4
  Top 0.762: ICSP.2 14.41,44.45 PTC.P$1
  Top 0.813: v12.7,38.1 9.72,38.1 PTC.P$1
  Bottom 0.508: A1.P$1 41.95,27.9 43.18,26.67 43.18,24.13 v42.55,23.49 | v36.83,38.73 36.2,38.73 35.56,39.37 34.93,40.01 34.93,46.36 33.66,47.62 28.57,47.62 26.67,45.72 ICSP.2
  Bottom 0.762: U1.5V 38.1,6.35 34.29,10.16 17.78,10.16 16.51,11.43 v16.51,21.59
  Bottom 0.813: v12.7,38.1 16.51,34.29
  Bottom 1.016: 16.51,34.29 v16.51,21.59

### Text on the board
tPlace: V 1.1 | A1 | A0 | openpipe.cc | MIDI-USB SHIELD